# Altium project Shark.PrjPcb
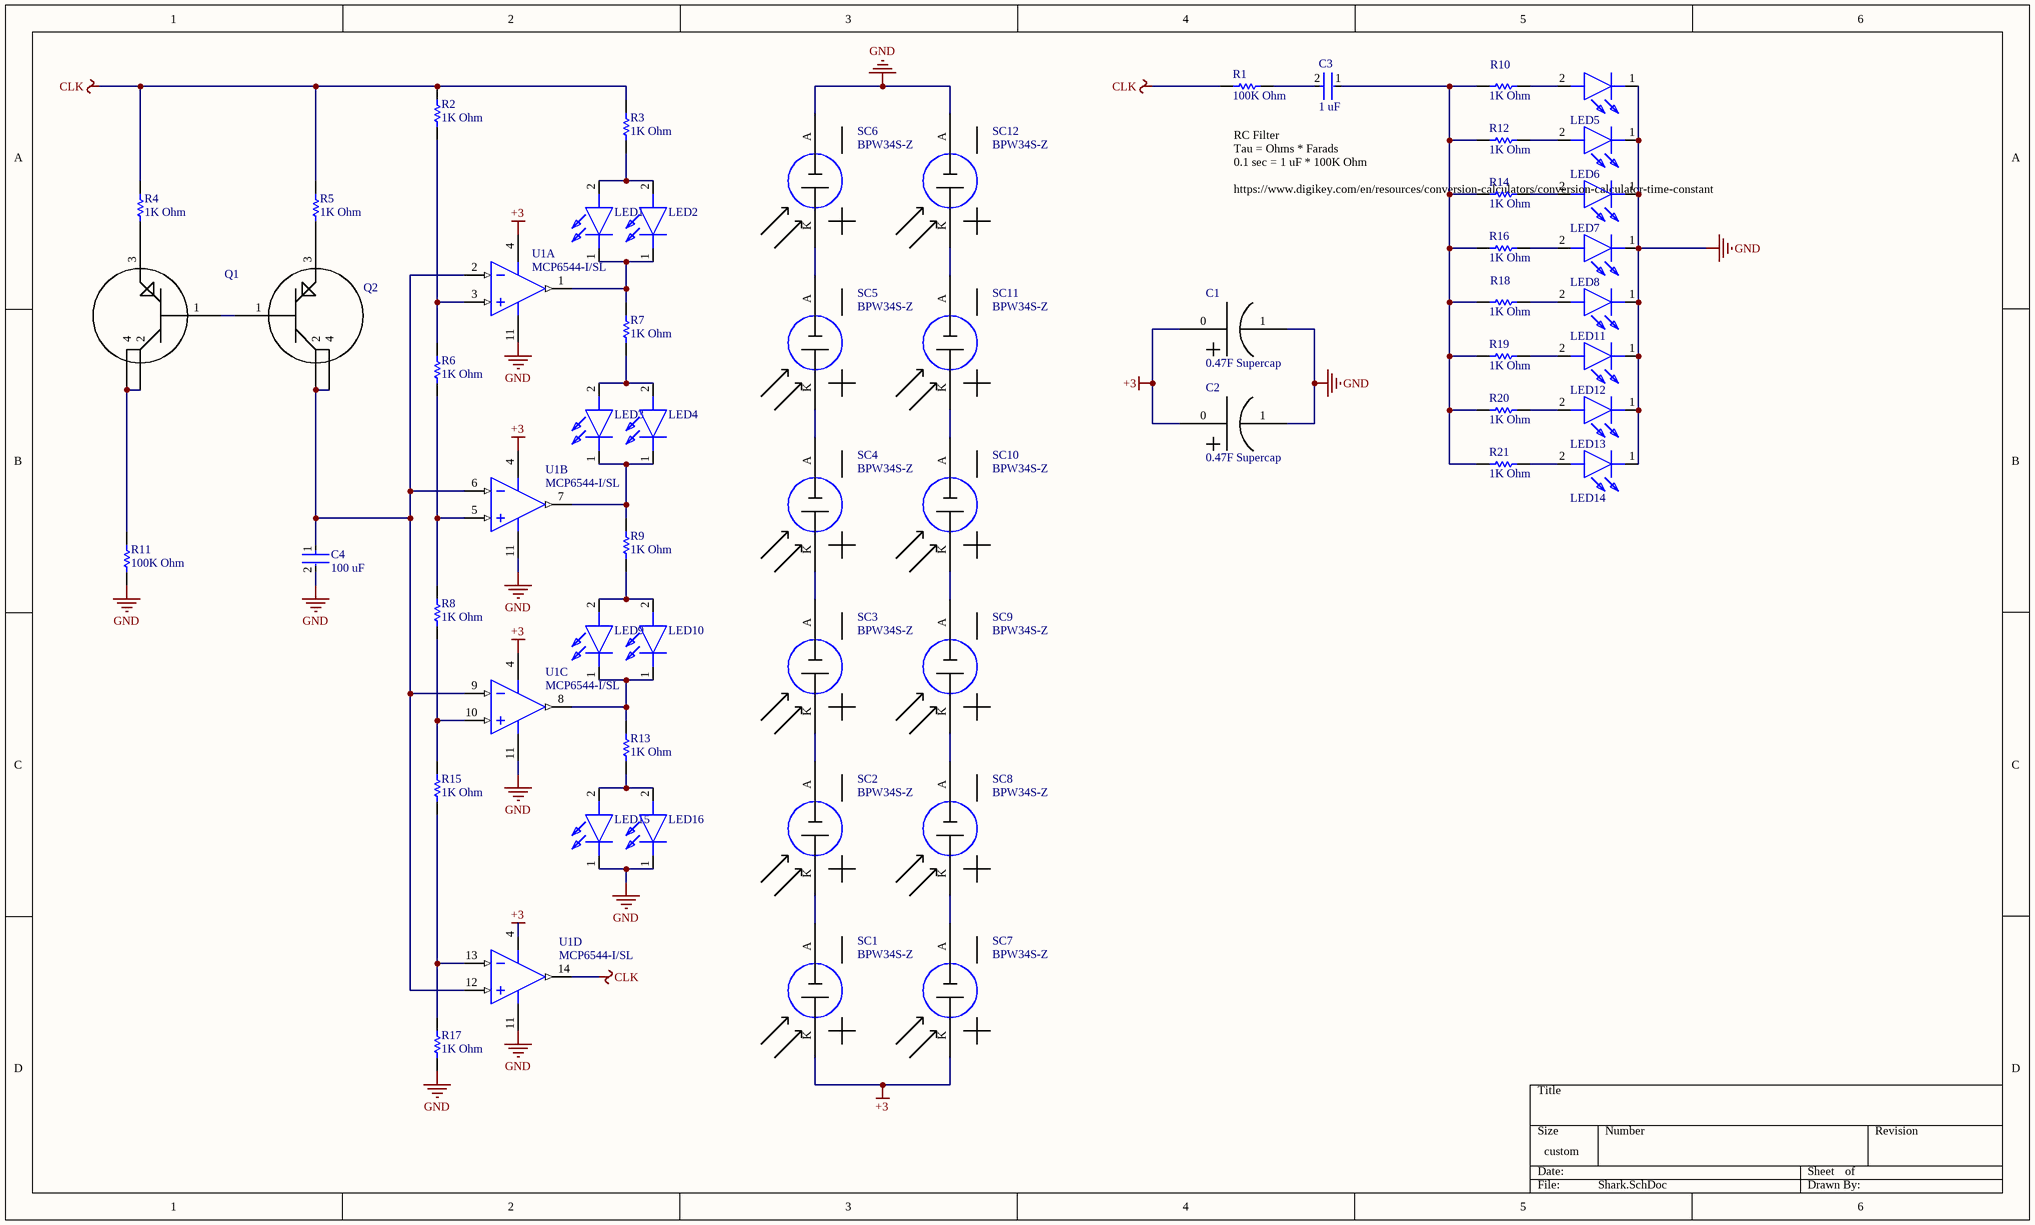
[diagram p0: Shark.SchDoc]
1 sheet, 56 parts. Net scope: global (net labels, ports and power ports of the same name join across sheets).
Board file: Shark.PcbDoc

## Sheet Shark.SchDoc
size 381 x 228 mm; SheetNumber: 1; SheetTotal: 1

### Parts
C1  0.47F Supercap  [JUMT1474MED]
C2  0.47F Supercap  [JUMT1474MED]
C3  1 uF  [FP-1812-L_4_5_0_3-W_3_2_0-IPC_B]
C4  100 uF  [FP-GRM21B-0_2-e0_2_0_7-IPC_A]
LED1  CSL1104WBBW1  [CSL1104WBBW1]  (value not drawn)
LED2  CSL1104WBBW1  [CSL1104WBBW1]  (value not drawn)
LED3  CSL1104WBBW1  [CSL1104WBBW1]  (value not drawn)
LED4  CSL1104WBBW1  [CSL1104WBBW1]  (value not drawn)
LED5  CSL1104WBBW1  [CSL1104WBBW1]  (value not drawn)
LED6  CSL1104WBBW1  [CSL1104WBBW1]  (value not drawn)
LED7  CSL1104WBBW1  [CSL1104WBBW1]  (value not drawn)
LED8  CSL1104WBBW1  [CSL1104WBBW1]  (value not drawn)
LED9  CSL1104WBBW1  [CSL1104WBBW1]  (value not drawn)
LED10  CSL1104WBBW1  [CSL1104WBBW1]  (value not drawn)
LED11  CSL1104WBBW1  [CSL1104WBBW1]  (value not drawn)
LED12  CSL1104WBBW1  [CSL1104WBBW1]  (value not drawn)
LED13  CSL1104WBBW1  [CSL1104WBBW1]  (value not drawn)
LED14  CSL1104WBBW1  [CSL1104WBBW1]  (value not drawn)
LED15  CSL1104WBBW1  [CSL1104WBBW1]  (value not drawn)
LED16  CSL1104WBBW1  [CSL1104WBBW1]  (value not drawn)
Q1  PZT3906T1G  [PZT3906T1G]  (value not drawn)
Q2  PZT3906T1G  [PZT3906T1G]  (value not drawn)
R1  100K Ohm  [RESC2013X60X35ML10T20]
R2  1K Ohm  [RESC2013X50X30NL20T20]
R3  1K Ohm  [RESC2013X50X30NL20T20]
R4  1K Ohm  [RESC2013X50X30NL20T20]
R5  1K Ohm  [RESC2013X50X30NL20T20]
R6  1K Ohm  [RESC2013X50X30NL20T20]
R7  1K Ohm  [RESC2013X50X30NL20T20]
R8  1K Ohm  [RESC2013X50X30NL20T20]
R9  1K Ohm  [RESC2013X50X30NL20T20]
R10  1K Ohm  [RESC2013X50X30NL20T20]
R11  100K Ohm  [RESC2013X60X35ML10T20]
R12  1K Ohm  [RESC2013X50X30NL20T20]
R13  1K Ohm  [RESC2013X50X30NL20T20]
R14  1K Ohm  [RESC2013X50X30NL20T20]
R15  1K Ohm  [RESC2013X50X30NL20T20]
R16  1K Ohm  [RESC2013X50X30NL20T20]
R17  1K Ohm  [RESC2013X50X30NL20T20]
R18  1K Ohm  [RESC2013X50X30NL20T20]
R19  1K Ohm  [RESC2013X50X30NL20T20]
R20  1K Ohm  [RESC2013X50X30NL20T20]
R21  1K Ohm  [RESC2013X50X30NL20T20]
SC1  BPW34S-Z  [BPW34S-Z]
SC2  BPW34S-Z  [BPW34S-Z]
SC3  BPW34S-Z  [BPW34S-Z]
SC4  BPW34S-Z  [BPW34S-Z]
SC5  BPW34S-Z  [BPW34S-Z]
SC6  BPW34S-Z  [BPW34S-Z]
SC7  BPW34S-Z  [BPW34S-Z]
SC8  BPW34S-Z  [BPW34S-Z]
SC9  BPW34S-Z  [BPW34S-Z]
SC10  BPW34S-Z  [BPW34S-Z]
SC11  BPW34S-Z  [BPW34S-Z]
SC12  BPW34S-Z  [BPW34S-Z]
U1  MCP6544-I/SL  [SOIC-SL14_N]  (parts A,B,C,D of 4)

### Nets
+3: C1.0 C2.0 SC1.K(Cathode) SC7.K(Cathode) U1.4(VDD)
CLK: R1.2 R2.2 R3.2 R4.2 R5.2 U1.14(OUTD)
GND: C1.1 C2.1 C4.2 LED5.1(K) LED6.1(K) LED7.1(K) LED8.1(K) LED11.1(K) LED12.1(K) LED13.1(K) LED14.1(K) LED15.1(K) LED16.1(K) R11.1 R17.1 SC6.A(Anode) SC12.A(Anode) U1.11(VSS)
NetC3_1: C3.1 R10.2 R12.2 R14.2 R16.2 R18.2 R19.2 R20.2 R21.2
NetC3_2: C3.2 R1.1
NetC4_1: C4.1 Q2.2 Q2.4 U1.2(VINA-) U1.6(VINB-) U1.9(VINC-) U1.12(VIND+)
NetLED1_1: LED1.1(K) LED2.1(K) R7.2 U1.1(OUTA)
NetLED1_2: LED1.2(A) LED2.2(A) R3.1
NetLED3_1: LED3.1(K) LED4.1(K) R9.2 U1.7(OUTB)
NetLED3_2: LED3.2(A) LED4.2(A) R7.1
NetLED5_2: LED5.2(A) R10.1
NetLED6_2: LED6.2(A) R12.1
NetLED7_2: LED7.2(A) R14.1
NetLED8_2: LED8.2(A) R16.1
NetLED9_1: LED9.1(K) LED10.1(K) R13.2 U1.8(OUTC)
NetLED9_2: LED9.2(A) LED10.2(A) R9.1
NetLED11_2: LED11.2(A) R18.1
NetLED12_2: LED12.2(A) R19.1
NetLED13_2: LED13.2(A) R20.1
NetLED14_2: LED14.2(A) R21.1
NetLED15_2: LED15.2(A) LED16.2(A) R13.1
NetQ1_1: Q1.1 Q2.1
NetQ1_2: Q1.2 Q1.4 R11.2
NetQ1_3: Q1.3 R4.1
NetQ2_3: Q2.3 R5.1
NetR2_1: R2.1 R6.2 U1.3(VINA+)
NetR6_1: R6.1 R8.2 U1.5(VINB+)
NetR8_1: R8.1 R15.2 U1.10(VINC+)
NetR15_1: R15.1 R17.2 U1.13(VIND-)
NetSC1_A: SC1.A(Anode) SC2.K(Cathode)
NetSC2_A: SC2.A(Anode) SC3.K(Cathode)
NetSC3_A: SC3.A(Anode) SC4.K(Cathode)
NetSC4_A: SC4.A(Anode) SC5.K(Cathode)
NetSC5_A: SC5.A(Anode) SC6.K(Cathode)
NetSC7_A: SC7.A(Anode) SC8.K(Cathode)
NetSC8_A: SC8.A(Anode) SC9.K(Cathode)
NetSC9_A: SC9.A(Anode) SC10.K(Cathode)
NetSC10_A: SC10.A(Anode) SC11.K(Cathode)
NetSC11_A: SC11.A(Anode) SC12.K(Cathode)

### Notes on the sheet
- RC Filter
  Tau = Ohms * Farads
  0.1 sec = 1 uF * 100K Ohm
  https://www.digikey.com/en/resources/conversion-calculators/conversion-calculator-time-constant

### Library data of the parts
C1 C2 = JUMT1474MED: Cap Supercap 0.47F 2.7V 20% (6.3 X 9mm) Radial 2.5mm 4 Ohm 1000h 70C Bulk Automotive; Manufacturer: Nichicon; Capacitance: 470mF; ESR (Equivalent Series Resistance): 4R; Leakage Current: 500uA; Life (Hours): 1000Hour; Lead Diameter: 0.5mm; Supplier 1: Digi-Key; Manufacturer Part Number: JUMT1474MED; RoHS: Yes; Category: Capacitors; Stock 1: 24; Pricing 1: 1=1.53000, 10=1.21100, 50=1.04980, 100=0.90860, 500=0.68646, 1000=0.60570, 2500=0.56532, 5000=0.54513 (USD); Mount: Through Hole; Case/Package: Radial; Number of Pins: 2; Min Operating Temperature: -25°C; Max Operating Temperature: 70°C; Tolerance: 20%; Termination: Radial; Packaging: Bulk; Package Quantity: 200; Voltage Rating: 2.7V; Voltage: 2.7V; Voltage Rating (DC): 2.7V; Series: UM; Construction: RADIAL; Diameter: 6.3mm; Length: 9mm; Height: 9mm; Lead Pitch: 2.5mm; Height - Seated (Max): 0.413inch; Depth: 9mm; Radiation Hardening: No; REACH SVHC: No SVHC; Lead Free: Lead Free; RoHS Compliant: Yes; ComponentLink1URL: https://datasheet.ciiva.com/11790/0900766b80ec956c-11790073.pdf?src-supplier=RSComponents; ComponentLink1Description: https://datasheet.ciiva.com/11790/0900766b80ec956c-11790073.pdf?src-supplier=RSComponents; ComponentLink2URL: https://datasheet.ciiva.com/238/e-um-238255.pdf?src-supplier=Digi-Key; ComponentLink2Description: https://datasheet.ciiva.com/238/e-um-238255.pdf?src-supplier=Digi-Key; ComponentLink3URL: https://datasheet.ciiva.com/2992/e-um-2992932.pdf?src-supplier=Avnet; ComponentLink3Description: https://datasheet.ciiva.com/2992/e-um-2992932.pdf?src-supplier=Avnet; ComponentLink4URL: https://datasheet.ciiva.com/1472/e-um-1472004.pdf?src-supplier=Farnell; ComponentLink4Description: https://datasheet.ciiva.com/1472/e-um-1472004.pdf?src-supplier=Farnell; ComponentLink5URL: https://datasheet.ciiva.com/17358/e-um-17358011.pdf?src-supplier=Avnet+Europe; ComponentLink5Description: https://datasheet.ciiva.com/17358/e-um-17358011.pdf?src-supplier=Avnet+Europe; Supplier Part Number 1: 493-3290-ND
C3 = CMP-2000-05504-2: General Purpose Ceramic Capacitor, 1812, 1uF, 10%, X7R, 15%, 100V; Dissipation Factor: 2.5%; Insulation Resistance: 100GR; Thickness: 0.09inch; Mount: Surface Mount; Package Quantity: 1; RoHS Compliant: Yes; Tolerance: 10%; Width: 0.126inch; Packaging: Tape and Reel; Case Code (Imperial): 1812; Capacitance: 1uF; Case Code (Metric): 4532; Voltage: 100V; Min Operating Temperature: -55°C; Depth: 3.2mm; Voltage Rating: 100V; Dielectric: X7R; Termination: SMD/SMT; Construction: Flat; Voltage Rating (DC): 100V; Lead Free: Lead Free; Height: 2.29mm; REACH SVHC: No SVHC; Series: 1812; Max Operating Temperature: 125°C; Radiation Hardening: No; Case/Package: 1812; Length: 4.5mm
C4 = CMP-2000-07599-2: Chip Multilayer Ceramic Capacitors for General Purpose, 0805, 100uF, X5R, 15%, 20%, 6.3V; Length: 0.079inch; Dielectric: X5R; Case Code (Metric): 2012; Max Operating Temperature: 85°C; Voltage Rating (DC): 6.3V; Min Operating Temperature: -55°C; Tolerance: 20%; Packaging: Cut Tape; Voltage Rating: 6.3V; Capacitance: 100uF; REACH SVHC: No SVHC; Width: 0.049inch; Mount: Surface Mount; Case/Package: 0805; Case Code (Imperial): 0805; Lead Free: Lead Free; Thickness: 0.057inch
LED1-LED16 = CSL1104WBBW1: LED; Manufacturer_Name: ROHM Semiconductor; Datasheet Link: https://fscdn.rohm.com/en/products/databook/datasheet/opto/led/chip_mono/csl1104wb1-e.pdf; Height: 0.65mm; Manufacturer_Part_Number: CSL1104WBBW1
Q1 Q2 = PZT3906T1G: Transistor Gp Bjt PNP 40V 200MA 4-PIN SOT-223 T/r; Manufacturer: ON Semiconductor; Collector Emitter Voltage (VCEO): 400mV; hFE Min: 60; Max Power Dissipation: 1.5W; Transition Frequency: 250MHz; Emitter Base Voltage (VEBO): 5V; Element Configuration: Single; Collector Base Voltage (VCBO): -40V; Collector Emitter Saturation Voltage: -400mV; Current Rating: -200mA; Supplier 1: Mouser; Manufacturer Part Number: PZT3906T1G; RoHS: Yes; Category: BJTs; Stock 1: 1663; Pricing 1: 1=0.71000, 10=0.62300, 50=0.62300, 100=0.47800, 1000=0.30100, 10000=0.30100 (USD); Mount: Surface Mount; Case/Package: TO-261-4; Min Operating Temperature: -55°C; Max Operating Temperature: 150°C; Packaging: Tape and Reel; Package Quantity: 1000; Max Collector Current: 200mA; Polarity: PNP; Collector Emitter Breakdown Voltage: 40V; Gain Bandwidth Product: 250MHz; Voltage Rating (DC): -40V; Series: -; Collector-emitter Voltage-Max: 400mV; Lead Free: Lead Free; RoHS Compliant: Yes; ComponentLink1URL: https://datasheet.ciiva.com/6357/pzt3906t1-d-6357904.pdf?src-supplier=Digi-Key; ComponentLink1Description: https://datasheet.ciiva.com/6357/pzt3906t1-d-6357904.pdf?src-supplier=Digi-Key; Supplier Part Number 1: 863-PZT3906T1G
R1 R11 = CMP-2100-03668-1: Chip Resistor, 100 KOhm, +/- 1%, 0.125 W, -55 to 155 degC, 0805 (2012 Metric), RoHS, Tape and Reel; Manufacturer: Yageo; Max Power Dissipation: 125mW; Voltage Rating: 150V; Temperature Coefficient: 100ppm/degreesC; Manufacturer URL: http://www.yageo.com/; Min Operating Temperature: -55degC; Lead Pitch: 0.4mm; Composition: ThickFilm; Case Code (Metric): 2012; Military Standard: Not; Package Description: 2-Pin Surface Mounted Device, Body 2 x 1.25 mm; REACH SVHC: Unknown; RoHSCompliant: true; Depth: 1.25mm; Number of Pins: 2; Lead Free: LeadFree; Resistance: 100KOhm; Datasheet URL: http://www.yageo.com/NewPortal/yageodocoutput?fileName=/pdf/R-Chip/PYu-RC_Group_51_RoHS_L_5.pdf; Max Operating Temperature: 155degC; Case/Package: 0805; Package Quantity: 1; Case Code (Imperial): 0805; Power Rating: 125mW; Width: 0.049inch; Package Reference: 0805; Height: 0.024inch; Termination: SMD/SMT; Tolerance: 1%; Datasheet Version: Rev. 5, 10/2016; Length: 2mm; Voltage Rating (DC): 150V; Number of Terminations: 2; Packaging: TapeandReel
R2-R10 R12-R21 = CMP-1013-00510-2: Part Number: CRCW08051K00FKEA; Manufacturer: Vishay Dale
SC1-SC12 = BPW34S-Z: Photodiode PIN Chip 850nm 0.62A/W Sensitivity Automotive 2-Pin DIL SMT; Manufacturer: Osram Opto; Viewing Angle: 120°; Forward Current: 100mA; Rise Time: 20ns; Reverse Voltage (DC): 32V; Max Power Dissipation: 150mW; Dark Current: 2nA; Supplier 1: Digi-Key; Manufacturer Part Number: BPW34S-Z; RoHS: Yes; Category: Phototransistor; Stock 1: 499; Pricing 1: 1=1.15000, 10=0.74900, 100=0.49070 (USD); Mount: Surface Mount; Case/Package: SMD/SMT; Number of Pins: 2; Contact Plating: Tin,Matte; Min Operating Temperature: -40°C; Max Operating Temperature: 100°C; Package Quantity: 1500; Wavelength: 850nm; Packaging: Tape and Reel; Response Time: 20ns; Fall Time: 20ns; Diode Type: PIN; Max Reverse Voltage (DC): 32V; Series: -; Responsivity: 0.62A/W; Radiation Hardening: No; RoHS Compliant: Yes; ComponentLink1URL: https://datasheet.ciiva.com/2819/bpw34-spdf-2819826.pdf?src-supplier=Digi-Key; ComponentLink1Description: https://datasheet.ciiva.com/2819/bpw34-spdf-2819826.pdf?src-supplier=Digi-Key; ComponentLink2URL: https://datasheet.ciiva.com/2819/bpw34-spdf-2819825.pdf?src-supplier=Digi-Key; ComponentLink2Description: https://datasheet.ciiva.com/2819/bpw34-spdf-2819825.pdf?src-supplier=Digi-Key; ComponentLink3URL: https://datasheet.ciiva.com/2819/bpw34-spdf-2819827.pdf?src-supplier=Digi-Key; ComponentLink3Description: https://datasheet.ciiva.com/2819/bpw34-spdf-2819827.pdf?src-supplier=Digi-Key; Supplier Part Number 1: 475-2659-1-ND
U1 = CMP-0187-00281-3: None; Power Supply Rejection Ratio (PSRR): 80dB; Supply Current: 1mA; Operating Supply Voltage: 5V; Min Supply Voltage: 1.6V; Amplifier Type: COMPARATOR; Propagation Delay: 8us; Output Current per Channel: 2mA; Max Input Current: 1pA; Hysteresis: 6.5mV; Quiescent Current: 1uA; Output Type: PUSH-PULL; Response Time: 4us; Input Offset Voltage (Vos): 7mV; Common Mode Rejection Ratio: 70dB; Number of Elements: 4; Max Supply Voltage: 5.5V; Length: 8.65mm; Number of Pins: 14; Height: 1.25mm; Lead Free: Lead Free; Technology: CMOS; Package Quantity: 57; Input Bias Current: 1pA; Max Operating Temperature: 85°C; Min Operating Temperature: -40°C; RoHS Compliant: Yes; Width: 3.9mm; Output Current: 2mA; Packaging: Rail/Tube; Number of Channels: 4; Max Supply Current: 1mA; Type: General Purpose; Case/Package: SOIC; Nominal Supply Current: 1mA; Mount: Surface Mount; Radiation Hardening: No